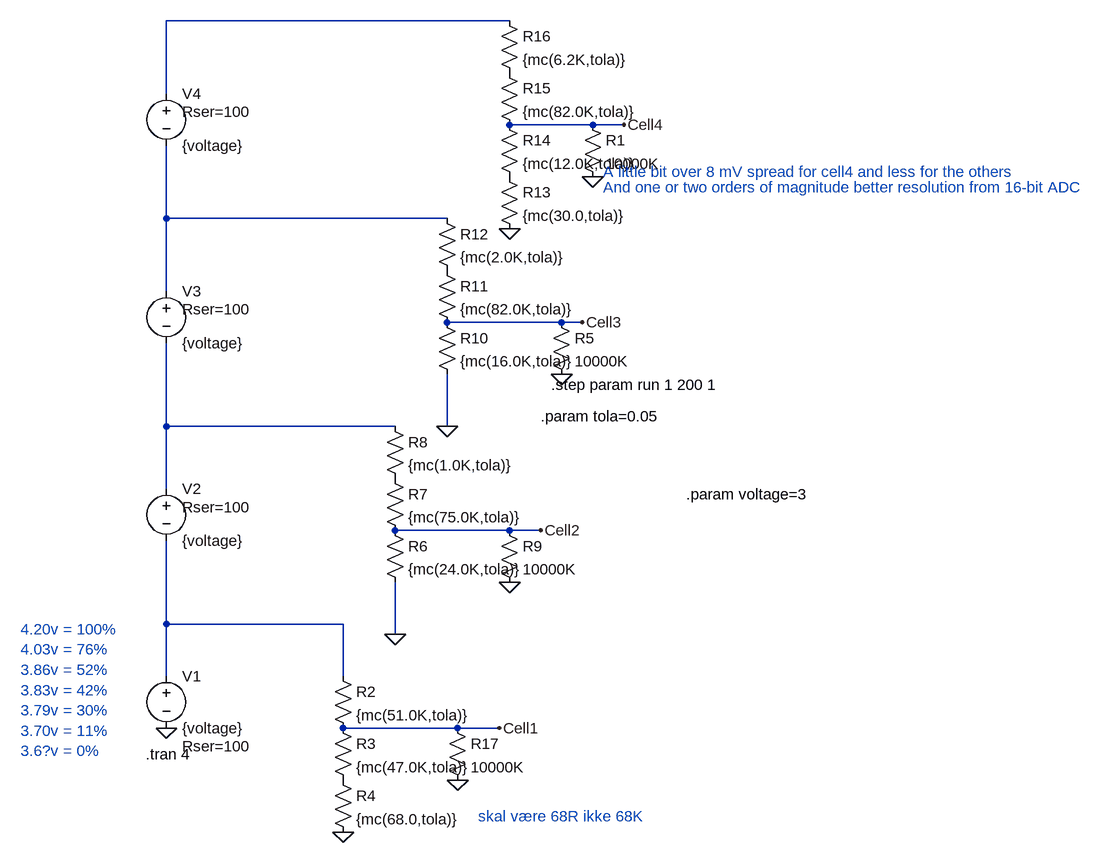
[diagram p0: schematic BatteryMonitorSingleEndedDividerTolerance.asc]
BatteryMonitorSingleEndedDividerTolerance.asc, the LTspice schematic file:
Version 4
SHEET 1 1644 680
WIRE 544 -800 16 -800
WIRE 16 -688 16 -800
WIRE 672 -640 544 -640
WIRE 720 -640 672 -640
WIRE 16 -496 16 -608
WIRE 448 -496 16 -496
WIRE 16 -384 16 -496
WIRE 624 -336 448 -336
WIRE 656 -336 624 -336
WIRE 16 -176 16 -304
WIRE 368 -176 16 -176
WIRE 448 -176 448 -256
WIRE 16 -80 16 -176
WIRE 544 -16 368 -16
WIRE 592 -16 544 -16
WIRE 16 128 16 0
WIRE 288 128 16 128
WIRE 368 144 368 64
WIRE 16 208 16 128
WIRE 288 208 288 128
WIRE 464 288 288 288
WIRE 528 288 464 288
FLAG 528 288 Cell1
FLAG 592 -16 Cell2
FLAG 656 -336 Cell3
FLAG 720 -640 Cell4
FLAG 544 -480 0
FLAG 448 -176 0
FLAG 368 144 0
FLAG 288 448 0
FLAG 16 288 0
FLAG 624 -256 0
FLAG 544 64 0
FLAG 464 368 0
FLAG 672 -560 0
SYMBOL voltage 16 192 R0
WINDOW 123 0 0 Left 2
WINDOW 39 24 124 Left 2
SYMATTR SpiceLine Rser=100
SYMATTR InstName V1
SYMATTR Value {voltage}
SYMBOL voltage 16 -96 R0
WINDOW 123 0 0 Left 2
WINDOW 39 24 44 Left 2
SYMATTR SpiceLine Rser=100
SYMATTR InstName V2
SYMATTR Value {voltage}
SYMBOL voltage 16 -400 R0
WINDOW 123 0 0 Left 2
WINDOW 39 24 44 Left 2
SYMATTR SpiceLine Rser=100
SYMATTR InstName V3
SYMATTR Value {voltage}
SYMBOL voltage 16 -704 R0
WINDOW 123 0 0 Left 2
WINDOW 39 24 44 Left 2
SYMATTR SpiceLine Rser=100
SYMATTR InstName V4
SYMATTR Value {voltage}
SYMBOL res 272 192 R0
SYMATTR InstName R2
SYMATTR Value {mc(51.0K,tola)}
SYMBOL res 272 272 R0
SYMATTR InstName R3
SYMATTR Value {mc(47.0K,tola)}
SYMBOL res 272 352 R0
SYMATTR InstName R4
SYMATTR Value {mc(68.0,tola)}
SYMBOL res 352 -32 R0
SYMATTR InstName R6
SYMATTR Value {mc(24.0K,tola)}
SYMBOL res 352 -112 R0
SYMATTR InstName R7
SYMATTR Value {mc(75.0K,tola)}
SYMBOL res 352 -192 R0
SYMATTR InstName R8
SYMATTR Value {mc(1.0K,tola)}
SYMBOL res 432 -352 R0
SYMATTR InstName R10
SYMATTR Value {mc(16.0K,tola)}
SYMBOL res 432 -432 R0
SYMATTR InstName R11
SYMATTR Value {mc(82.0K,tola)}
SYMBOL res 432 -512 R0
SYMATTR InstName R12
SYMATTR Value {mc(2.0K,tola)}
SYMBOL res 528 -576 R0
SYMATTR InstName R13
SYMATTR Value {mc(30.0,tola)}
SYMBOL res 528 -656 R0
SYMATTR InstName R14
SYMATTR Value {mc(12.0K,tola)}
SYMBOL res 528 -736 R0
SYMATTR InstName R15
SYMATTR Value {mc(82.0K,tola)}
SYMBOL res 528 -816 R0
SYMATTR InstName R16
SYMATTR Value {mc(6.2K,tola)}
SYMBOL res 656 -656 R0
SYMATTR InstName R1
SYMATTR Value 10000K
SYMBOL res 608 -352 R0
SYMATTR InstName R5
SYMATTR Value 10000K
SYMBOL res 528 -32 R0
SYMATTR InstName R9
SYMATTR Value 10000K
SYMBOL res 448 272 R0
SYMATTR InstName R17
SYMATTR Value 10000K
TEXT -16 328 Left 2 !.tran 4
TEXT -208 136 Left 2 ;4.20v = 100%\n4.03v = 76%\n3.86v = 52%\n3.83v = 42%\n3.79v = 30%\n3.70v = 11%\n3.6?v = 0%
TEXT 688 -568 Left 2 ;A little bit over 8 mV spread for cell4 and less for the others
TEXT 688 -544 Left 2 ;And one or two orders of magnitude better resolution from 16-bit ADC
TEXT 592 -192 Left 2 !.param tola=0.05
TEXT 608 -240 Left 2 !.step param run 1 200 1
TEXT 816 -72 Left 2 !.param voltage=3
TEXT 496 424 Left 2 ;skal være 68R ikke 68K

The netlist it stands for:
* BatteryMonitorSingleEndedDividerTolerance.asc
V1 N004 0 {voltage} Rser=100
V2 N003 N004 {voltage} Rser=100
V3 N002 N003 {voltage} Rser=100
V4 N001 N002 {voltage} Rser=100
R2 N004 Cell1 {mc(51.0K,tola)}
R3 Cell1 P001 {mc(47.0K,tola)}
R4 P001 0 {mc(68.0,tola)}
R6 Cell2 0 {mc(24.0K,tola)}
R7 P002 Cell2 {mc(75.0K,tola)}
R8 N003 P002 {mc(1.0K,tola)}
R10 Cell3 0 {mc(16.0K,tola)}
R11 P003 Cell3 {mc(82.0K,tola)}
R12 N002 P003 {mc(2.0K,tola)}
R13 P004 0 {mc(30.0,tola)}
R14 Cell4 P004 {mc(12.0K,tola)}
R15 P005 Cell4 {mc(82.0K,tola)}
R16 N001 P005 {mc(6.2K,tola)}
R1 Cell4 0 10000K
R5 Cell3 0 10000K
R9 Cell2 0 10000K
R17 Cell1 0 10000K
.tran 4
* 4.20v = 100%
* 4.03v = 76%
* 3.86v = 52%
* 3.83v = 42%
* 3.79v = 30%
* 3.70v = 11%
* 3.6?v = 0%
* A little bit over 8 mV spread for cell4 and less for the others
* And one or two orders of magnitude better resolution from 16-bit ADC
.param tola=0.05
.step param run 1 200 1
.param voltage=3
* skal være 68R ikke 68K
.backanno
.end